# EAGLE schematic QuadM4FC (EAGLE 6.5.0)

## Sheet 1 of 7: MCU
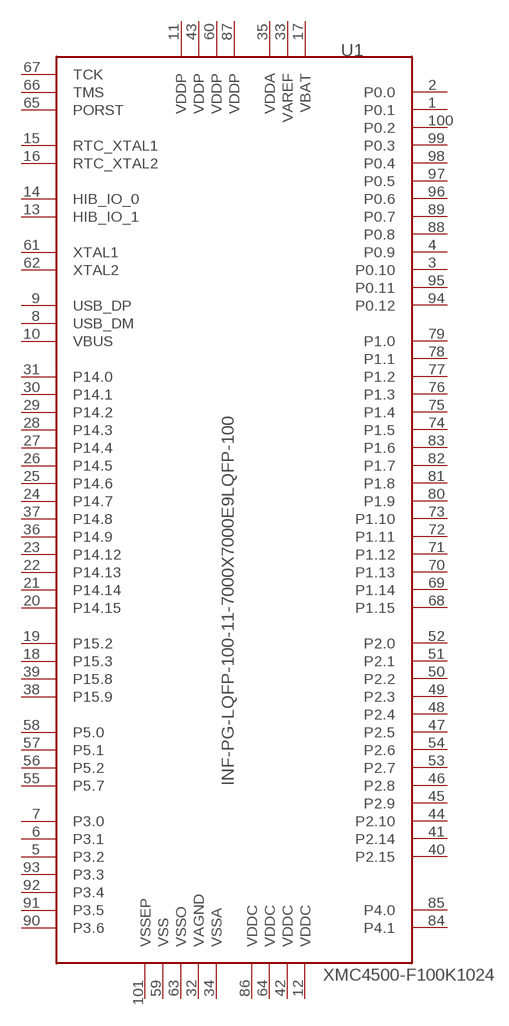
[diagram p0: schematic, sheet 1]

### Parts
U1  INF-PG-LQFP-100-11-7000X7000E9LQFP-100  [INF-PG-LQFP-100-11-7000X7000E9PRIMARY]
Unconnected: U1.1(P0.1) U1.2(P0.0) U1.3(P0.10) U1.4(P0.9) U1.5(P3.2) U1.6(P3.1) U1.7(P3.0) U1.8(USB_DM) U1.9(USB_DP) U1.10(VBUS) U1.11(VDDP) U1.12(VDDC) U1.13(HIB_IO_1) U1.14(HIB_IO_0) U1.15(RTC_XTAL1) U1.16(RTC_XTAL2) U1.17(VBAT) U1.18(P15.3) U1.19(P15.2) U1.20(P14.15) U1.21(P14.14) U1.22(P14.13) U1.23(P14.12) U1.24(P14.7) U1.25(P14.6) U1.26(P14.5) U1.27(P14.4) U1.28(P14.3) U1.29(P14.2) U1.30(P14.1) U1.31(P14.0) U1.32(VAGND) U1.33(VAREF) U1.34(VSSA) U1.35(VDDA) U1.36(P14.9) U1.37(P14.8) U1.38(P15.9) U1.39(P15.8) U1.40(P2.15) U1.41(P2.14) U1.42(VDDC) U1.43(VDDP) U1.44(P2.10) U1.45(P2.9) U1.46(P2.8) U1.47(P2.5) U1.48(P2.4) U1.49(P2.3) U1.50(P2.2) U1.51(P2.1) U1.52(P2.0) U1.53(P2.7) U1.54(P2.6) U1.55(P5.7) U1.56(P5.2) U1.57(P5.1) U1.58(P5.0) U1.59(VSS) U1.60(VDDP) U1.61(XTAL1) U1.62(XTAL2) U1.63(VSSO) U1.64(VDDC) U1.65(PORST) U1.66(TMS) U1.67(TCK) U1.68(P1.15) U1.69(P1.14) U1.70(P1.13) U1.71(P1.12) U1.72(P1.11) U1.73(P1.10) U1.74(P1.5) U1.75(P1.4) U1.76(P1.3) U1.77(P1.2) U1.78(P1.1) U1.79(P1.0) U1.80(P1.9) U1.81(P1.8) U1.82(P1.7) U1.83(P1.6) U1.84(P4.1) U1.85(P4.0) U1.86(VDDC) U1.87(VDDP) U1.88(P0.8) U1.89(P0.7) U1.90(P3.6) U1.91(P3.5) U1.92(P3.4) U1.93(P3.3) U1.94(P0.12) U1.95(P0.11) U1.96(P0.6) U1.97(P0.5) U1.98(P0.4) U1.99(P0.3) U1.100(P0.2) U1.101(VSSEP)

## Sheet 2 of 7: Sensors
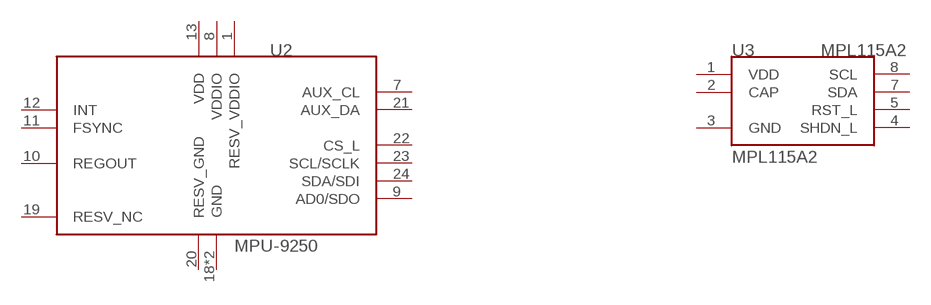
[diagram p1: schematic, sheet 2]

### Parts
U2  MPU-9250  [QFN-24-4MM2]
U3  MPL115A2  [MPL115A2]
Unconnected: U2.7(AUX_CL) U2.9(AD0/SDO) U2.10(REGOUT) U2.11(FSYNC) U2.12(INT) U2.19(RESV_NC) U2.21(AUX_DA) U2.22(CS_L) U2.23(SCL/SCLK) U2.24(SDA/SDI) U3.1(VDD) U3.2(CAP) U3.3(GND) U3.4(SHDN_L) U3.5(RST_L) U3.7(SDA) U3.8(SCL)

## Sheet 3 of 7: 2.4 GHz Radio
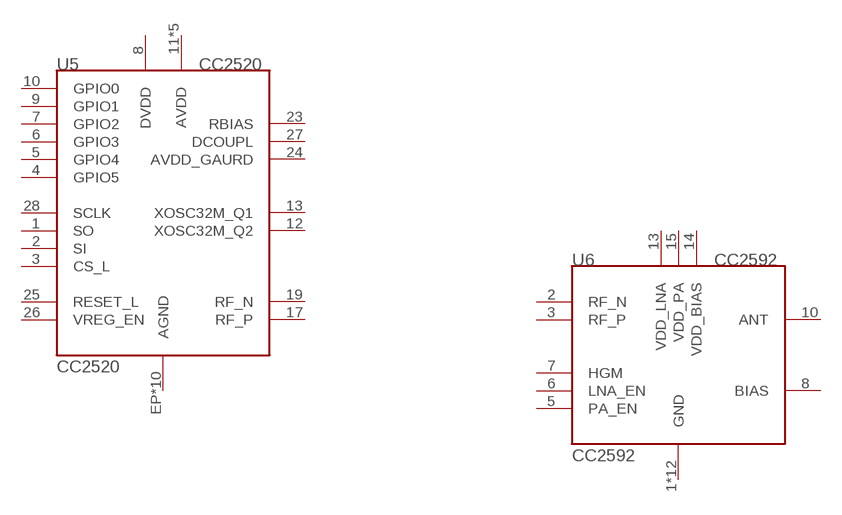
[diagram p2: schematic, sheet 3]

### Parts
U5  CC2520  [RHD_S-PVQFN-N28]
U6  CC2592  [RGV_S-PVGFN-N16]
Unconnected: U5.1(SO) U5.2(SI) U5.3(CS_L) U5.4(GPIO5) U5.5(GPIO4) U5.6(GPIO3) U5.7(GPIO2) U5.8(DVDD) U5.9(GPIO1) U5.10(GPIO0) U5.11(AVDD) U5.12(XOSC32M_Q2) U5.13(XOSC32M_Q1) U5.14(AVDD) U5.16(AVDD) U5.17(RF_P) U5.19(RF_N) U5.20(AVDD) U5.22(AVDD) U5.23(RBIAS) U5.24(AVDD_GAURD) U5.25(RESET_L) U5.26(VREG_EN) U5.27(DCOUPL) U5.28(SCLK) U5.EP(AGND) U5.EXP@1(AGND) U5.EXP@2(AGND) U5.EXP@3(AGND) U5.EXP@4(AGND) U5.EXP@5(AGND) U5.EXP@6(AGND) U5.EXP@7(AGND) U5.EXP@8(AGND) U5.EXP@9(AGND) U6.1(GND) U6.2(RF_N) U6.3(RF_P) U6.4(GND) U6.5(PA_EN) U6.6(LNA_EN) U6.7(HGM) U6.8(BIAS) U6.9(GND) U6.10(ANT) U6.11(GND) U6.12(GND) U6.13(VDD_LNA) U6.14(VDD_BIAS) U6.15(VDD_PA) U6.16(GND) U6.EP(GND) U6.EP@1(GND) U6.EP@2(GND) U6.EP@3(GND) U6.EP@4(GND) U6.EP@5(GND)

## Sheet 4 of 7: 900MHz Radio
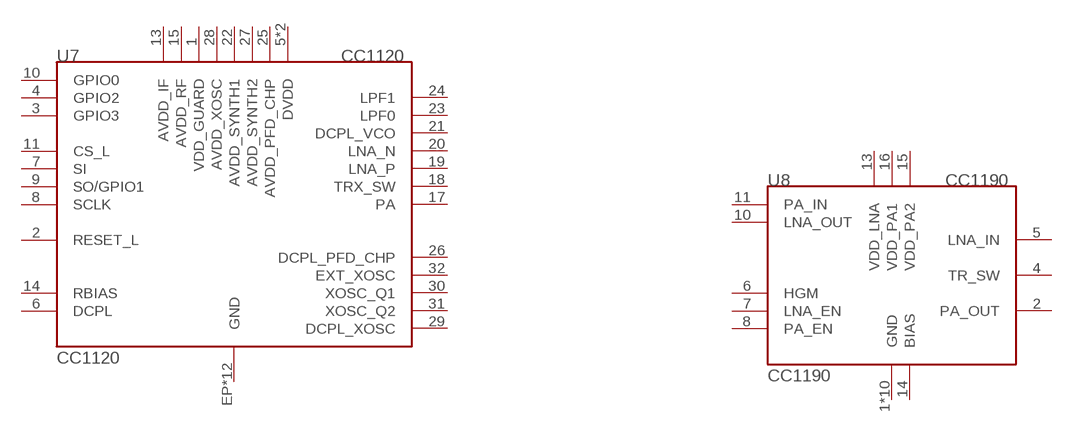
[diagram p3: schematic, sheet 4]

### Parts
U7  CC1120  [RHB_S-PVQFN-N32]
U8  CC1190  [RGV_S-PVGFN-N16]
Unconnected: U7.1(VDD_GUARD) U7.2(RESET_L) U7.3(GPIO3) U7.4(GPIO2) U7.5(DVDD) U7.6(DCPL) U7.7(SI) U7.8(SCLK) U7.9(SO/GPIO1) U7.10(GPIO0) U7.11(CS_L) U7.12(DVDD) U7.13(AVDD_IF) U7.14(RBIAS) U7.15(AVDD_RF) U7.17(PA) U7.18(TRX_SW) U7.19(LNA_P) U7.20(LNA_N) U7.21(DCPL_VCO) U7.22(AVDD_SYNTH1) U7.23(LPF0) U7.24(LPF1) U7.25(AVDD_PFD_CHP) U7.26(DCPL_PFD_CHP) U7.27(AVDD_SYNTH2) U7.28(AVDD_XOSC) U7.29(DCPL_XOSC) U7.30(XOSC_Q1) U7.31(XOSC_Q2) U7.32(EXT_XOSC) U7.EP(GND) U7.EXP@1(GND) U7.EXP@2(GND) U7.EXP@3(GND) U7.EXP@4(GND) U7.EXP@5(GND) U7.EXP@6(GND) U7.EXP@7(GND) U7.EXP@8(GND) U7.EXP@9(GND) U7.EXP@10(GND) U7.EXP@11(GND) U8.1(GND) U8.2(PA_OUT) U8.3(GND) U8.4(TR_SW) U8.5(LNA_IN) U8.6(HGM) U8.7(LNA_EN) U8.8(PA_EN) U8.9(GND) U8.10(LNA_OUT) U8.11(PA_IN) U8.12(GND) U8.13(VDD_LNA) U8.14(BIAS) U8.15(VDD_PA2) U8.16(VDD_PA1) U8.EP(GND) U8.EP@1(GND) U8.EP@2(GND) U8.EP@3(GND) U8.EP@4(GND) U8.EP@5(GND)

## Sheet 5 of 7: Flash Memory
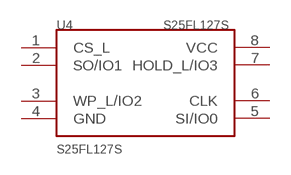
[diagram p4: schematic, sheet 5]

### Parts
U4  S25FL127S  [SO8]
Unconnected: U4.1(CS_L) U4.2(SO/IO1) U4.3(WP_L/IO2) U4.4(GND) U4.5(SI/IO0) U4.6(CLK) U4.7(HOLD_L/IO3) U4.8(VCC)

## Sheet 6 of 7: Power

## Sheet 7 of 7: Connectors

## Power pins joined to a net without a drawn wire
GND: U2.18(GND) U2.EP(GND)
RESV_GND: U2.20(RESV_GND)
RESV_VDDIO: U2.1(RESV_VDDIO)
VDD: U2.13(VDD)
VDDIO: U2.8(VDDIO)

## Library data of the parts
U1 = XMC4500-F100K1024 AB:INF-PG-LQFP-100-11-7000X7000E9
U2 = Invesense:MPU-9250
U3 = Sensors:MPL115A2
U4 = memory:S25FL127S
U5 = ti_rf:CC2520
U6 = ti_rf:CC2592
U7 = ti_rf:CC1120
U8 = ti_rf:CC1190